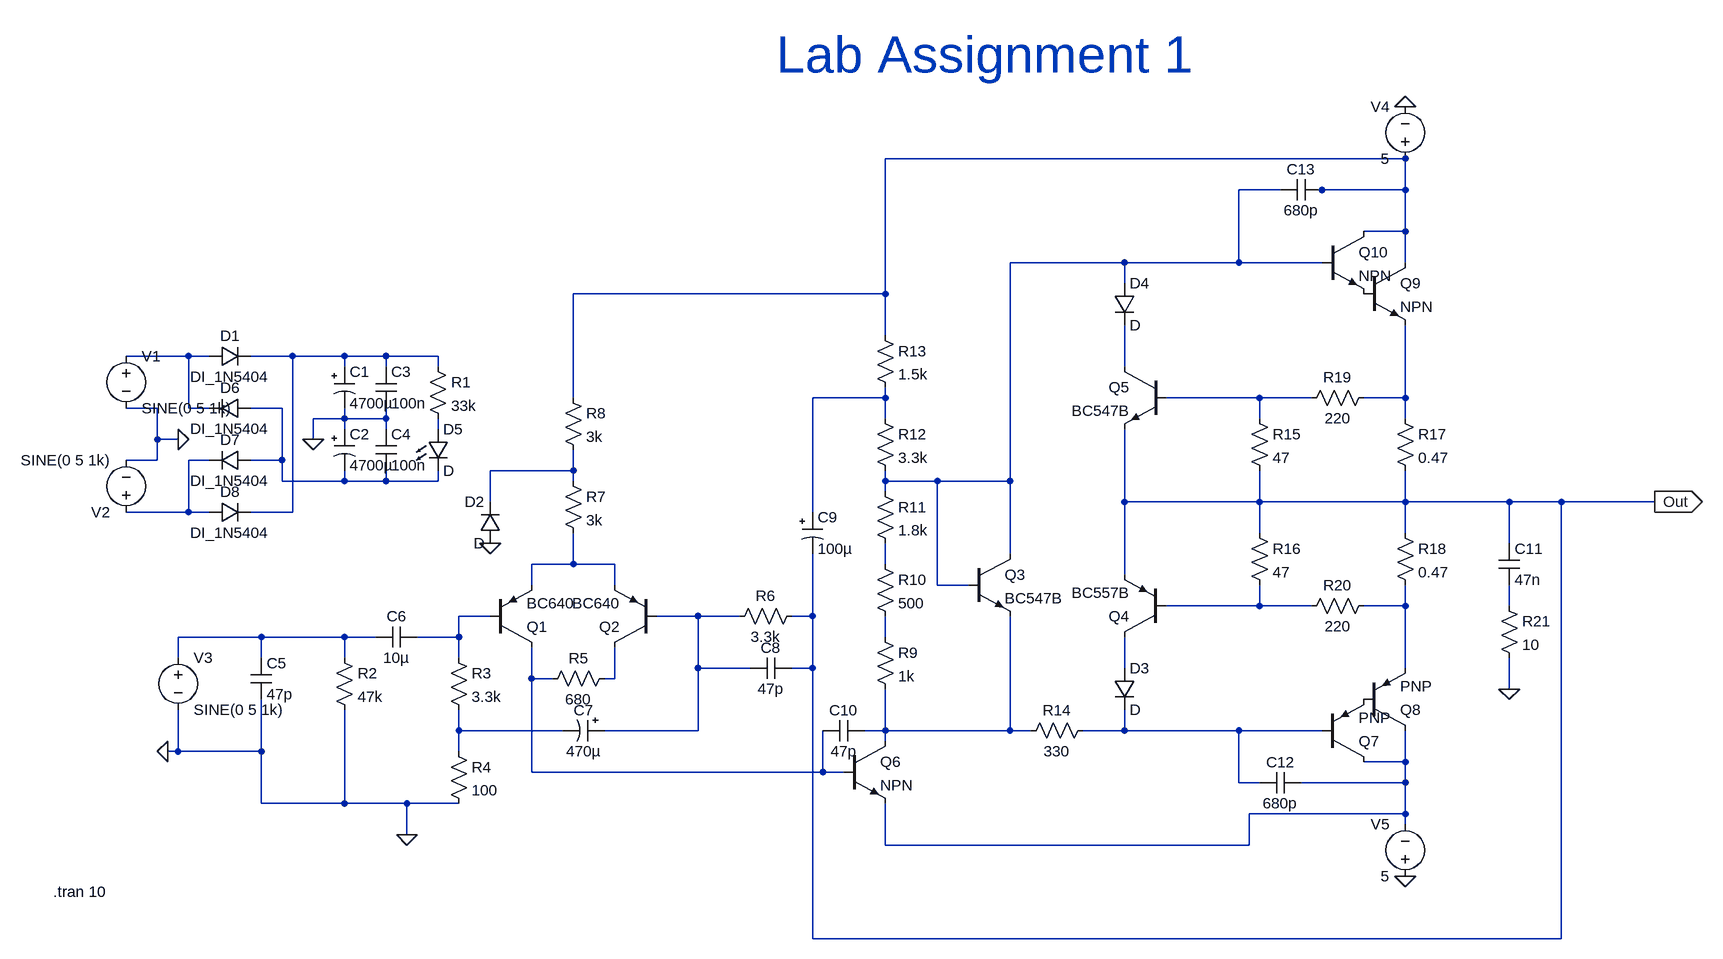
[diagram p0: schematic Lab1.asc]
Lab1.asc, the LTspice schematic file:
Version 4
SHEET 1 2820 964
WIRE 1952 -240 1152 -240
WIRE 1760 -192 1696 -192
WIRE 1824 -192 1808 -192
WIRE 1952 -192 1952 -240
WIRE 1952 -192 1824 -192
WIRE 1952 -128 1952 -192
WIRE 1952 -128 1888 -128
WIRE 1520 -80 1344 -80
WIRE 1696 -80 1696 -192
WIRE 1696 -80 1520 -80
WIRE 1824 -80 1696 -80
WIRE 1952 -80 1952 -128
WIRE 1520 -48 1520 -80
WIRE 1152 -32 1152 -240
WIRE 1152 -32 672 -32
WIRE 1152 32 1152 -32
WIRE 80 64 -16 64
WIRE 112 64 80 64
WIRE 240 64 176 64
WIRE 320 64 240 64
WIRE 384 64 320 64
WIRE 464 64 384 64
WIRE 320 80 320 64
WIRE 384 80 384 64
WIRE 464 80 464 64
WIRE 1520 80 1520 16
WIRE 672 128 672 -32
WIRE 1152 128 1152 112
WIRE 1152 128 1040 128
WIRE 1728 128 1584 128
WIRE 1808 128 1728 128
WIRE 1952 128 1952 16
WIRE 1952 128 1888 128
WIRE 32 144 -16 144
WIRE 80 144 80 64
WIRE 112 144 80 144
WIRE 224 144 176 144
WIRE 320 160 320 144
WIRE 320 160 272 160
WIRE 384 160 384 144
WIRE 384 160 320 160
WIRE 1152 160 1152 128
WIRE 1728 160 1728 128
WIRE 1952 160 1952 128
WIRE 320 176 320 160
WIRE 384 176 384 160
WIRE 464 176 464 160
WIRE 32 192 32 144
WIRE 64 192 32 192
WIRE 272 192 272 160
WIRE 32 224 32 192
WIRE 32 224 -16 224
WIRE 112 224 80 224
WIRE 224 224 224 144
WIRE 224 224 176 224
WIRE 672 240 672 208
WIRE 672 240 544 240
WIRE 224 256 224 224
WIRE 320 256 320 240
WIRE 320 256 224 256
WIRE 384 256 384 240
WIRE 384 256 320 256
WIRE 464 256 464 240
WIRE 464 256 384 256
WIRE 672 256 672 240
WIRE 1152 256 1152 240
WIRE 1232 256 1152 256
WIRE 1344 256 1344 -80
WIRE 1344 256 1232 256
WIRE 1152 272 1152 256
WIRE 544 288 544 240
WIRE 1520 288 1520 176
WIRE 1728 288 1728 240
WIRE 1728 288 1520 288
WIRE 1952 288 1952 240
WIRE 1952 288 1728 288
WIRE 2112 288 1952 288
WIRE 2192 288 2112 288
WIRE 2336 288 2192 288
WIRE 80 304 80 224
WIRE 80 304 -16 304
WIRE 112 304 80 304
WIRE 240 304 240 64
WIRE 240 304 176 304
WIRE 1040 304 1040 128
WIRE 1728 336 1728 288
WIRE 1952 336 1952 288
WIRE 2112 352 2112 288
WIRE 1344 368 1344 256
WIRE 672 384 672 336
WIRE 672 384 608 384
WIRE 736 384 672 384
WIRE 1152 384 1152 352
WIRE 1520 400 1520 288
WIRE 608 416 608 384
WIRE 736 416 736 384
WIRE 1232 416 1232 256
WIRE 1280 416 1232 416
WIRE 1728 448 1728 416
WIRE 1728 448 1584 448
WIRE 1808 448 1728 448
WIRE 1952 448 1952 416
WIRE 1952 448 1888 448
WIRE 2112 448 2112 416
WIRE 544 464 496 464
WIRE 864 464 800 464
WIRE 928 464 864 464
WIRE 1040 464 1040 368
WIRE 1040 464 1008 464
WIRE 192 496 64 496
WIRE 320 496 192 496
WIRE 368 496 320 496
WIRE 496 496 496 464
WIRE 496 496 432 496
WIRE 1152 496 1152 464
WIRE 64 528 64 496
WIRE 192 528 192 496
WIRE 320 528 320 496
WIRE 496 528 496 496
WIRE 864 544 864 464
WIRE 944 544 864 544
WIRE 1040 544 1040 464
WIRE 1040 544 1008 544
WIRE 1520 544 1520 496
WIRE 1952 544 1952 448
WIRE 608 560 608 512
WIRE 640 560 608 560
WIRE 736 560 736 512
WIRE 736 560 720 560
WIRE 2112 576 2112 528
WIRE 496 640 496 608
WIRE 656 640 496 640
WIRE 864 640 864 544
WIRE 864 640 720 640
WIRE 1152 640 1152 576
WIRE 1152 640 1120 640
WIRE 1344 640 1344 464
WIRE 1344 640 1152 640
WIRE 1376 640 1344 640
WIRE 1520 640 1520 608
WIRE 1520 640 1456 640
WIRE 1696 640 1520 640
WIRE 1824 640 1696 640
WIRE 1152 656 1152 640
WIRE 64 672 64 608
WIRE 64 672 48 672
WIRE 192 672 192 592
WIRE 192 672 64 672
WIRE 496 672 496 640
WIRE 1952 688 1952 640
WIRE 1952 688 1888 688
WIRE 608 704 608 560
WIRE 1056 704 1056 640
WIRE 1056 704 608 704
WIRE 1088 704 1056 704
WIRE 1696 720 1696 640
WIRE 1728 720 1696 720
WIRE 1952 720 1952 688
WIRE 1952 720 1792 720
WIRE 192 752 192 672
WIRE 320 752 320 608
WIRE 320 752 192 752
WIRE 416 752 320 752
WIRE 496 752 416 752
WIRE 1952 768 1952 720
WIRE 1952 768 1712 768
WIRE 1952 784 1952 768
WIRE 416 800 416 752
WIRE 1152 816 1152 752
WIRE 1712 816 1712 768
WIRE 1712 816 1152 816
WIRE 1040 960 1040 544
WIRE 2192 960 2192 288
WIRE 2192 960 1040 960
FLAG 272 192 0
FLAG 416 800 0
FLAG 544 352 0
FLAG 2112 576 0
FLAG 48 672 0
FLAG 64 192 0
FLAG 1952 -320 0
FLAG 1952 864 0
FLAG 2336 288 Out
IOPIN 2336 288 Out
SYMBOL diode 112 80 R270
WINDOW 0 32 32 VTop 2
WINDOW 3 0 32 VBottom 2
SYMATTR InstName D1
SYMATTR Value DI_1N5404
SYMBOL polcap 304 80 R0
WINDOW 3 24 56 Left 2
SYMATTR Value 4700µ
SYMATTR InstName C1
SYMATTR Description Capacitor
SYMATTR Type cap
SYMATTR SpiceLine V=50 Irms=3.355 Rser=0.004 Lser=14.4n mfg="Würth Elektronik" pn="860010683032 WCAP-ATG8 22x41" type="Al electrolytic"
SYMBOL polcap 304 176 R0
WINDOW 3 24 56 Left 2
SYMATTR Value 4700µ
SYMATTR InstName C2
SYMATTR Description Capacitor
SYMATTR Type cap
SYMATTR SpiceLine V=50 Irms=3.355 Rser=0.004 Lser=14.4n mfg="Würth Elektronik" pn="860010683032 WCAP-ATG8 22x41" type="Al electrolytic"
SYMBOL cap 368 80 R0
SYMATTR InstName C3
SYMATTR Value 100n
SYMBOL cap 368 176 R0
SYMATTR InstName C4
SYMATTR Value 100n
SYMBOL res 448 64 R0
SYMATTR InstName R1
SYMATTR Value 33k
SYMBOL LED 448 176 R0
SYMATTR InstName D5
SYMBOL diode 176 128 R90
WINDOW 0 0 32 VBottom 2
WINDOW 3 32 32 VTop 2
SYMATTR InstName D6
SYMATTR Value DI_1N5404
SYMBOL diode 176 208 R90
WINDOW 0 0 32 VBottom 2
WINDOW 3 32 32 VTop 2
SYMATTR InstName D7
SYMATTR Value DI_1N5404
SYMBOL diode 112 320 R270
WINDOW 0 32 32 VTop 2
WINDOW 3 0 32 VBottom 2
SYMATTR InstName D8
SYMATTR Value DI_1N5404
SYMBOL cap 176 528 R0
SYMATTR InstName C5
SYMATTR Value 47p
SYMBOL res 304 512 R0
SYMATTR InstName R2
SYMATTR Value 47k
SYMBOL cap 432 480 R90
WINDOW 0 0 32 VBottom 2
WINDOW 3 32 32 VTop 2
SYMATTR InstName C6
SYMATTR Value 10µ
SYMATTR SpiceLine V=10 Irms=0 Rser=0.0037 Lser=501p mfg="Würth Elektronik" pn="885012207026 WCAP-CSGP 0805" type="X7R"
SYMBOL res 480 512 R0
SYMATTR InstName R3
SYMATTR Value 3.3k
SYMBOL res 480 656 R0
SYMATTR InstName R4
SYMATTR Value 100
SYMBOL polcap 720 624 R90
WINDOW 0 0 32 VBottom 2
WINDOW 3 32 32 VTop 2
SYMATTR InstName C7
SYMATTR Value 470µ
SYMATTR Description Capacitor
SYMATTR Type cap
SYMATTR SpiceLine V=16 Irms=320m Rser=0.091 Lser=6.84n mfg="Würth Elektronik" pn="865230357008 WCAP-AS5H 10x10,5" type="Al electrolytic"
SYMBOL res 736 544 R90
WINDOW 0 0 56 VBottom 2
WINDOW 3 32 56 VTop 2
SYMATTR InstName R5
SYMATTR Value 680
SYMBOL res 1024 448 R90
WINDOW 0 0 56 VBottom 2
WINDOW 3 32 56 VTop 2
SYMATTR InstName R6
SYMATTR Value 3.3k
SYMBOL cap 1008 528 R90
WINDOW 0 0 32 VBottom 2
WINDOW 3 32 32 VTop 2
SYMATTR InstName C8
SYMATTR Value 47p
SYMBOL res 656 240 R0
SYMATTR InstName R7
SYMATTR Value 3k
SYMBOL res 656 112 R0
SYMATTR InstName R8
SYMATTR Value 3k
SYMBOL diode 560 352 R180
WINDOW 0 24 64 Left 2
WINDOW 3 24 0 Left 2
SYMATTR InstName D2
SYMBOL voltage -16 48 R0
WINDOW 123 0 0 Left 0
WINDOW 39 0 0 Left 0
SYMATTR InstName V1
SYMATTR Value SINE(0 5 1k)
SYMBOL pnp 544 512 M180
SYMATTR InstName Q1
SYMATTR Value BC640
SYMBOL pnp 800 512 R180
SYMATTR InstName Q2
SYMATTR Value BC640
SYMBOL polcap 1024 304 R0
WINDOW 3 24 56 Left 2
SYMATTR Value 100µ
SYMATTR InstName C9
SYMATTR Description Capacitor
SYMATTR Type cap
SYMATTR SpiceLine V=50 Irms=3.3m Rser=3.094 Lser=3.76n mfg="Würth Elektronik" pn="860010672001 WCAP-ATG8 5x11" type="Al electrolytic"
SYMBOL res 1136 480 R0
SYMATTR InstName R9
SYMATTR Value 1k
SYMBOL res 1136 368 R0
SYMATTR InstName R10
SYMATTR Value 500
SYMBOL res 1136 256 R0
SYMATTR InstName R11
SYMATTR Value 1.8k
SYMBOL res 1136 144 R0
SYMATTR InstName R12
SYMATTR Value 3.3k
SYMBOL res 1136 16 R0
SYMATTR InstName R13
SYMATTR Value 1.5k
SYMBOL cap 1120 624 R90
WINDOW 0 0 32 VBottom 2
WINDOW 3 32 32 VTop 2
SYMATTR InstName C10
SYMATTR Value 47p
SYMBOL res 1472 624 R90
WINDOW 0 0 56 VBottom 2
WINDOW 3 32 56 VTop 2
SYMATTR InstName R14
SYMATTR Value 330
SYMBOL npn 1280 368 R0
SYMATTR InstName Q3
SYMATTR Value BC547B
SYMBOL pnp 1584 496 R180
SYMATTR InstName Q4
SYMATTR Value BC557B
SYMBOL diode 1504 544 R0
SYMATTR InstName D3
SYMBOL npn 1584 80 M0
SYMATTR InstName Q5
SYMATTR Value BC547B
SYMBOL diode 1504 -48 R0
SYMATTR InstName D4
SYMBOL res 1712 144 R0
SYMATTR InstName R15
SYMATTR Value 47
SYMBOL res 1712 320 R0
SYMATTR InstName R16
SYMATTR Value 47
SYMBOL res 1936 144 R0
SYMATTR InstName R17
SYMATTR Value 0.47
SYMATTR SpiceLine pwr=5
SYMBOL res 1936 320 R0
SYMATTR InstName R18
SYMATTR Value 0.47
SYMATTR SpiceLine pwr=5
SYMBOL res 1904 112 R90
WINDOW 0 0 56 VBottom 2
WINDOW 3 32 56 VTop 2
SYMATTR InstName R19
SYMATTR Value 220
SYMBOL res 1904 432 R90
WINDOW 0 0 56 VBottom 2
WINDOW 3 32 56 VTop 2
SYMATTR InstName R20
SYMATTR Value 220
SYMBOL cap 2096 352 R0
SYMATTR InstName C11
SYMATTR Value 47n
SYMBOL res 2096 432 R0
SYMATTR InstName R21
SYMATTR Value 10
SYMBOL npn 1088 656 R0
SYMATTR InstName Q6
SYMBOL pnp 1824 688 M180
SYMATTR InstName Q7
SYMBOL pnp 1888 640 M180
SYMATTR InstName Q8
SYMBOL cap 1792 704 R90
WINDOW 0 0 32 VBottom 2
WINDOW 3 32 32 VTop 2
SYMATTR InstName C12
SYMATTR Value 680p
SYMBOL npn 1888 -80 R0
SYMATTR InstName Q9
SYMBOL npn 1824 -128 R0
SYMATTR InstName Q10
SYMBOL cap 1824 -208 R90
WINDOW 0 0 32 VBottom 2
WINDOW 3 32 32 VTop 2
SYMATTR InstName C13
SYMATTR Value 680p
SYMBOL voltage -16 320 R180
WINDOW 123 0 0 Left 0
WINDOW 39 0 0 Left 0
SYMATTR InstName V2
SYMATTR Value SINE(0 5 1k)
SYMBOL voltage 64 512 R0
WINDOW 123 0 0 Left 0
WINDOW 39 0 0 Left 0
SYMATTR InstName V3
SYMATTR Value SINE(0 5 1k)
SYMBOL voltage 1952 -224 R180
WINDOW 0 24 96 Left 2
WINDOW 3 24 16 Left 2
WINDOW 123 0 0 Left 0
WINDOW 39 0 0 Left 0
SYMATTR InstName V4
SYMATTR Value 5
SYMBOL voltage 1952 880 R180
WINDOW 0 24 96 Left 2
WINDOW 3 24 16 Left 2
WINDOW 123 0 0 Left 0
WINDOW 39 0 0 Left 0
SYMATTR InstName V5
SYMATTR Value 5
TEXT -128 888 Left 2 !.tran 10
TEXT 984 -400 Left 6 ;Lab Assignment 1

The netlist it stands for:
* Lab1.asc
D1 N003 N004 DI_1N5404
C1 N004 0 4700µ V=50 Irms=3.355 Rser=0.004 Lser=14.4n mfg="Würth Elektronik" pn="860010683032 WCAP-ATG8 22x41" type="Al electrolytic"
C2 0 N009 4700µ V=50 Irms=3.355 Rser=0.004 Lser=14.4n mfg="Würth Elektronik" pn="860010683032 WCAP-ATG8 22x41" type="Al electrolytic"
C3 N004 0 100n
C4 0 N009 100n
R1 N004 N010 33k
D5 N010 N009 D
D6 N009 N003 DI_1N5404
D7 N009 N011 DI_1N5404
D8 N011 N004 DI_1N5404
C5 N020 0 47p
R2 N020 0 47k
C6 N018 N020 10µ V=10 Irms=0 Rser=0.0037 Lser=501p mfg="Würth Elektronik" pn="885012207026 WCAP-CSGP 0805" type="X7R"
R3 N018 N025 3.3k
R4 N025 0 100
C7 N019 N025 470µ V=16 Irms=320m Rser=0.091 Lser=6.84n mfg="Würth Elektronik" pn="865230357008 WCAP-AS5H 10x10,5" type="Al electrolytic"
R5 N024 N023 680
R6 Out N019 3.3k
C8 Out N019 47p
R7 N012 N013 3k
R8 N001 N012 3k
D2 0 N012 D
V1 N003 0 SINE(0 5 1k)
Q1 N023 N018 N013 0 BC640
Q2 N024 N019 N013 0 BC640
C9 N006 Out 100µ V=50 Irms=3.3m Rser=3.094 Lser=3.76n mfg="Würth Elektronik" pn="860010672001 WCAP-ATG8 5x11" type="Al electrolytic"
R9 N021 N026 1k
R10 N014 N021 500
R11 N002 N014 1.8k
R12 N006 N002 3.3k
R13 N001 N006 1.5k
C10 N026 N023 47p
R14 N027 N026 330
Q3 N002 N002 N026 0 BC547B
Q4 N022 N015 Out 0 BC557B
D3 N022 N027 D
Q5 N005 N007 Out 0 BC547B
D4 N002 N005 D
R15 N007 Out 47
R16 Out N015 47
R17 N008 Out 0.47 pwr=5
R18 Out N016 0.47 pwr=5
R19 N008 N007 220
R20 N016 N015 220
C11 Out N017 47n
R21 N017 0 10
Q6 N026 N023 N028 0 NPN
Q7 N028 N027 P001 0 PNP
Q8 N028 P001 N016 0 PNP
C12 N028 N027 680p
Q9 N001 P002 N008 0 NPN
Q10 N001 N002 P002 0 NPN
C13 N001 N002 680p
V2 N011 0 SINE(0 5 1k)
V3 N020 0 SINE(0 5 1k)
V4 N001 0 5
V5 0 N028 5
.model D D
.lib standard.dio
.model NPN NPN
.model PNP PNP
.lib standard.bjt
.tran 10
* Lab Assignment 1
.backanno
.end